# Altium project PROC154E3_SCH.PrjPcb (part 39 of 60)

## Sheet 44. SGMII EXPANSION HDR.SchDoc: ENET EXPANSION CONNECTOR
size 513 x 386 mm; Project: PROC154E2(001)_SK_AM69; Issue: 1.0; RevCode: E3; Page Create Date: March  8, 1995; Variant Name: Core Design; Schematic Page Number: 44; Page Number: 44; Page Size: C; Comment: MISTRAL_TITLEBLK_CSIZE_1; Page Count: 62; Schematic Page Count: 62; Name: PROC154E2 001 SK AM69; DsnPath: C:\Users\danie\Downloads\sprr466c\PROC154E3_RP\PROC154E3_SCH.DSN; SchematicName: SCHEMATIC1; PageName: 44. SGMII EXPANSION HDR; PageSize: C; TopSchematic: True
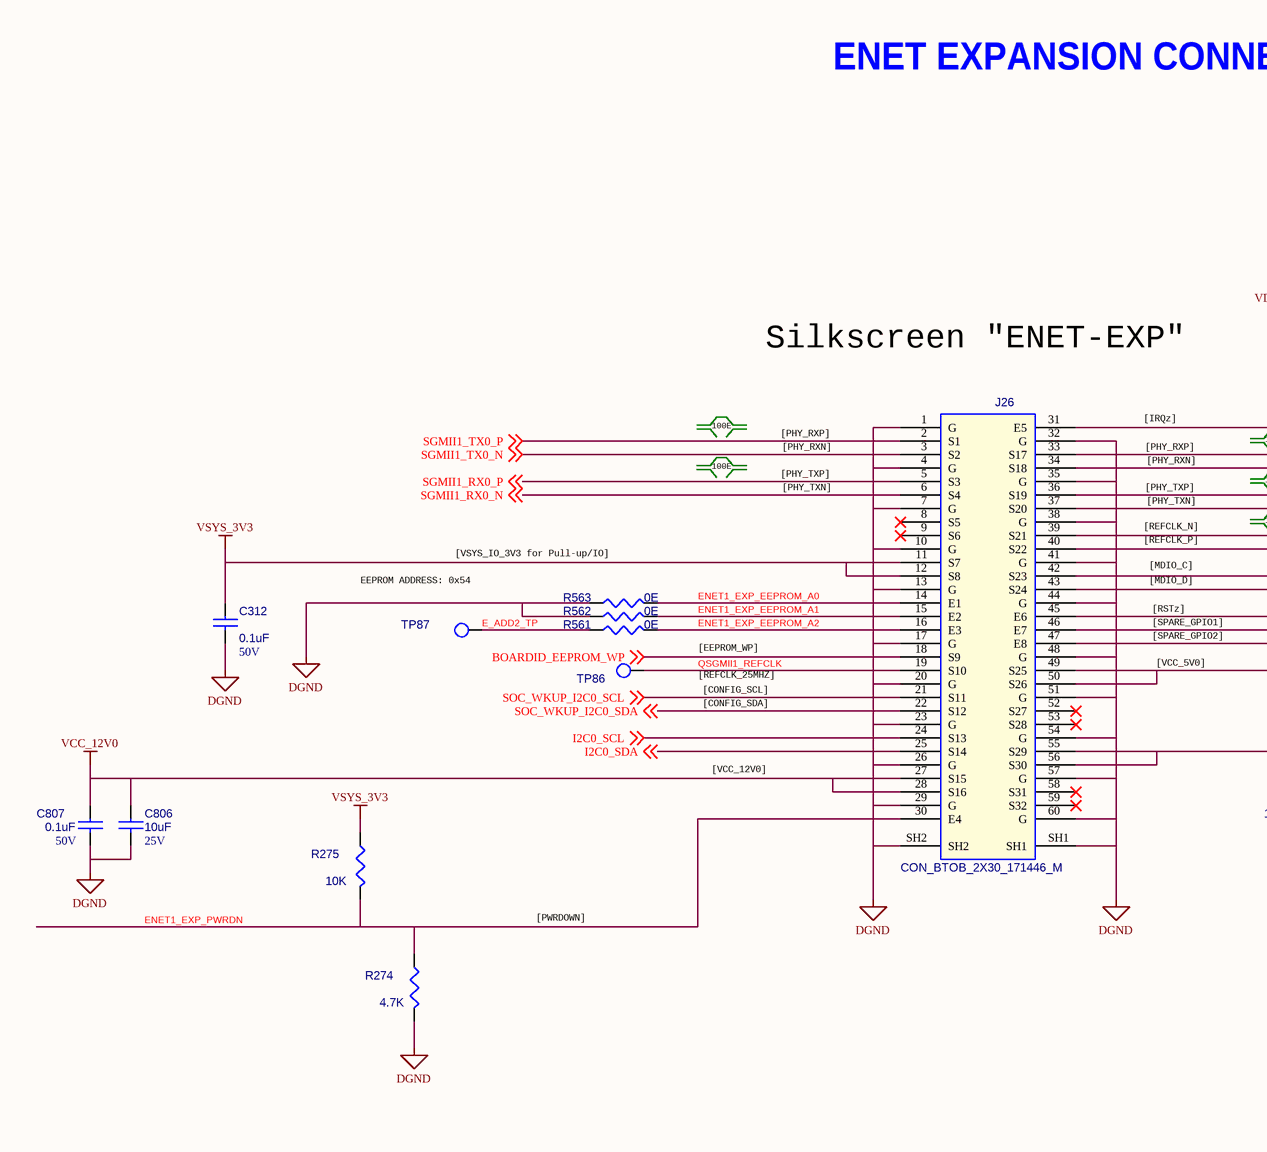
[diagram p72: 44. SGMII EXPANSION HDR.SchDoc, left]
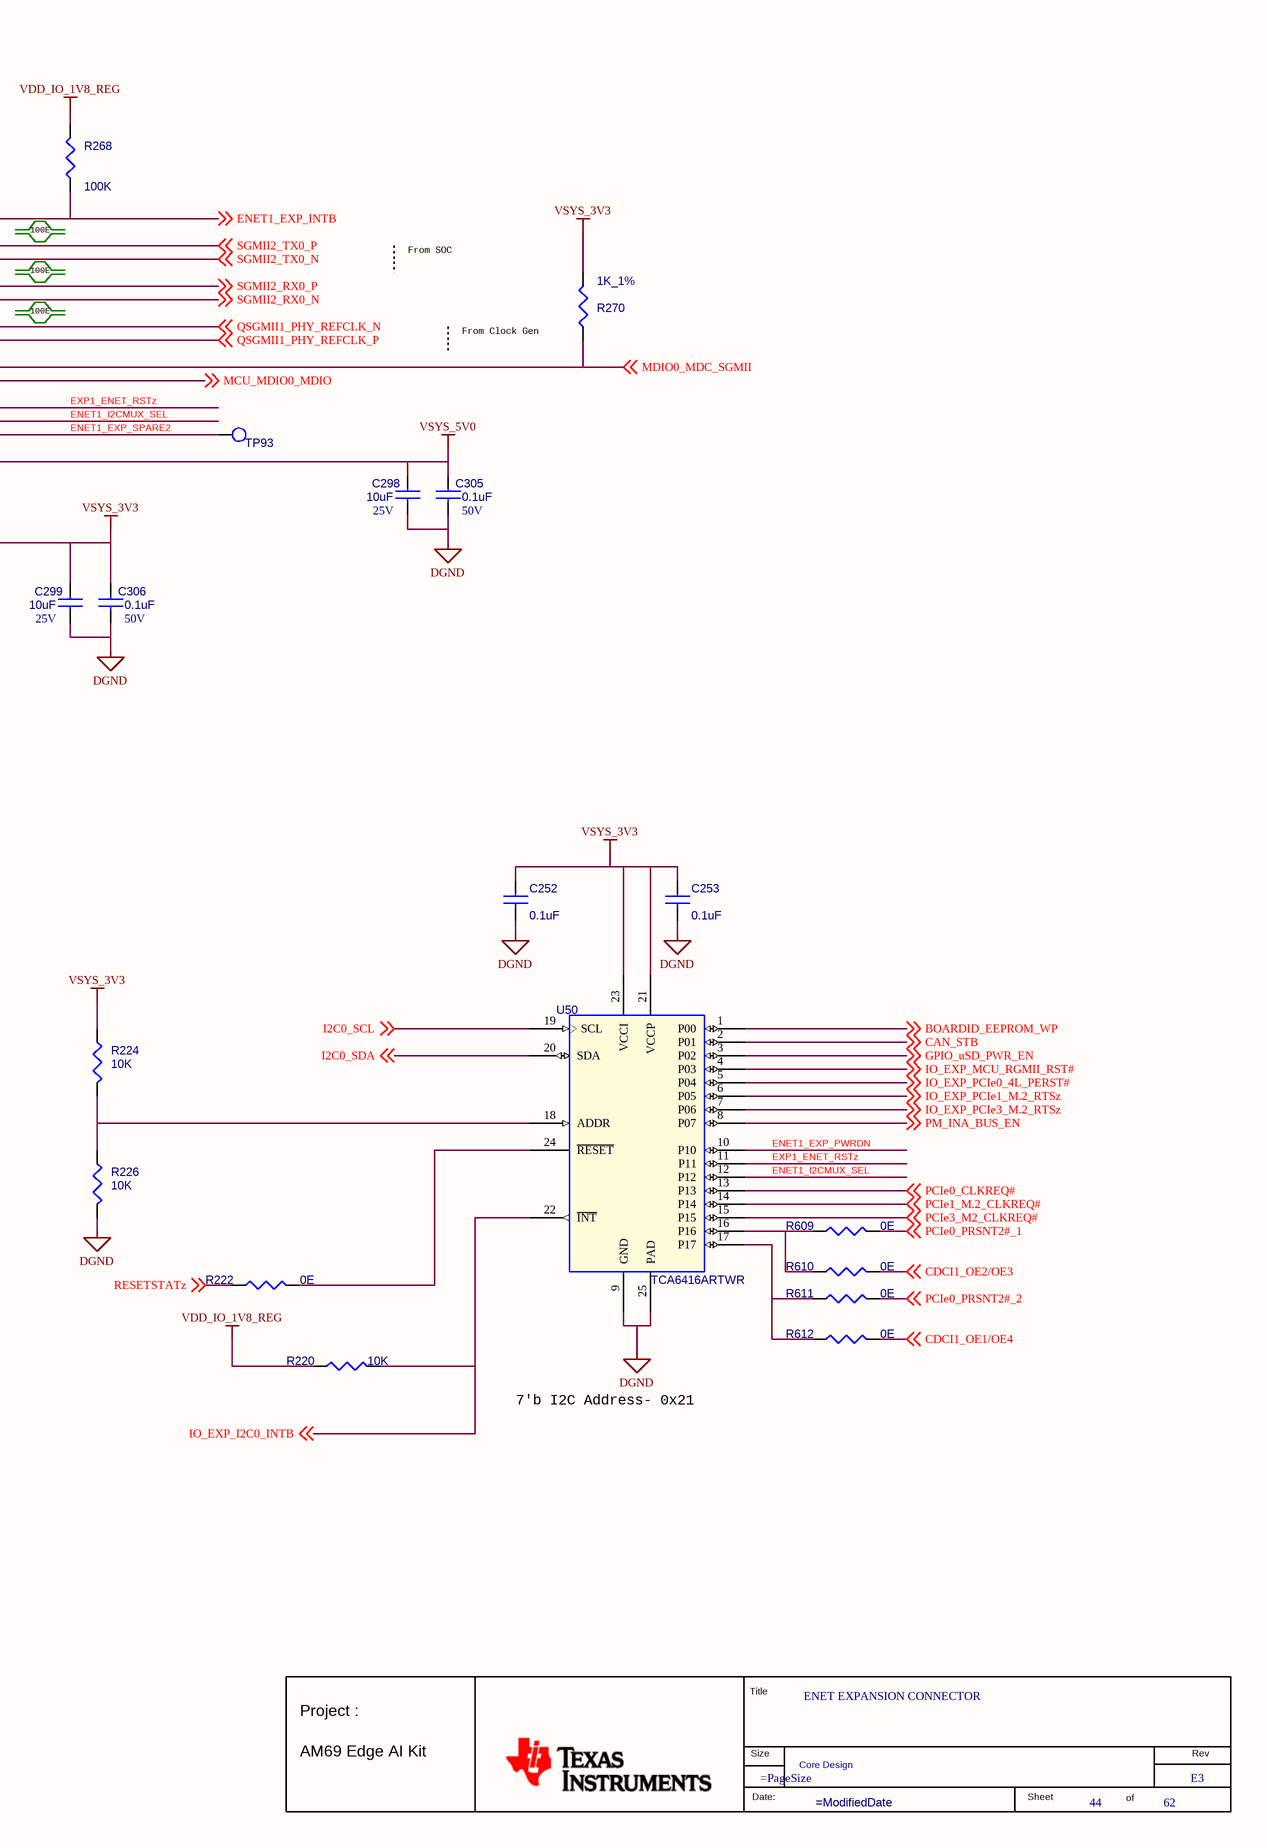
[diagram p73: 44. SGMII EXPANSION HDR.SchDoc, right]

### Parts
(Parts that share a designator on the sheet are numbered #1, #2 ... from top to bottom, then left to right.)
*#44  RevCode: E3  Title: ENET EXPANSION CONNECTOR  Page Number: 44  Page Count: 62  Variant Name: Core Design  (hidden comment: MISTRAL_TITLEBLK_CSIZE_1)  (graphical)
C252  0.1uF  [CAP0201_0-5]
C253  0.1uF  [CAP0201_0-5]
C298  10uF  Voltage: 25V  [CAP0603_1-25]
C299  10uF  Voltage: 25V  [CAP0603_1-25]
C305  0.1uF  Voltage: 50V  [CAP0402_0-75]
C306  0.1uF  Voltage: 50V  [CAP0402_0-75]
C312  0.1uF  Voltage: 50V  [CAP0402_0-75]
C806  10uF  Voltage: 25V  [CAP0603_1-25]
C807  0.1uF  Voltage: 50V  [CAP0402_0-75]
J26  CON_BTOB_2X30_171446_M  [CON_BTOB2X30_171446-09_P_S_S_3-5]
R220  10K  [RES0201_0-5]
R222  0E  [RES0201_0-5]
R224  10K  [RES0201_0-5]
R226  10K  [RES0201_0-5]
R268  100K  [RES0402_0-5]
R270  1K_1%  [RES0402_0-5]
R274  4.7K  [RES0402_0-5]
R275  10K  [RES0402_0-5]
R561  0E  [RES0402_0-5]
R562  0E  [RES0402_0-5]
R563  0E  [RES0402_0-5]
R609  0E  [RES0201_0-5]
R610  0E  [RES0201_0-5]
R611  0E  [RES0201_0-5]
R612  0E  [RES0201_0-5]
TP86  TP40_SMD  [TP40_SMD]  (value not drawn)
TP87  TP40_SMD  [TP40_SMD]  (value not drawn)
TP93  TP40_SMD  [TP40_SMD]  (value not drawn)
U50  TCA6416ARTWR  [WQFN24_19-68_160X160]

### Nets
DGND: C252.2 C253.2 C298.2 C299.2 C305.2 C306.2 C312.2 C806.2 C807.2 J26.1(G) J26.4(G) J26.7(G) J26.10(G) J26.13(G) J26.17(G) J26.20(G) J26.23(G) J26.26(G) J26.29(G) J26.32(G) J26.35(G) J26.38(G) J26.41(G) J26.44(G) J26.48(G) J26.51(G) J26.54(G) J26.57(G) J26.60(G) J26.SH1 J26.SH2 R226.1 R274.2 R562.1 R563.1 U50.9(GND) U50.25(PAD)  [project net VDD_CPU_HCPS_GOSNS]
VCC_12V0: C806.1 C807.1 J26.27(S15) J26.28(S16)
VDD_IO_1V8_REG: R220.2 R268.2
VSYS_3V3: C252.1 C253.1 C299.1 C306.1 C312.1 J26.11(S7) J26.12(S8) J26.55(S29) J26.56(S30) R224.2 R270.1 R275.1 U50.21(VCCP) U50.23(VCCI)  [project net V_3V3]
VSYS_5V0: C298.1 C305.1 J26.49(S25) J26.50(S26)
BOARDID_EEPROM_WP: J26.18(S9) U50.1(P00) ; off-sheet BOARDID_EEPROM_WP
CAN_STB: U50.2(P01) ; off-sheet CAN_STB
CDCI1_OE1/OE4: R612.2 ; off-sheet CDCI1_OE1/OE4  [project net CDCI1_OE4]
CDCI1_OE2/OE3: R610.2 ; off-sheet CDCI1_OE2/OE3  [project net CDCI1_OE2]
E_ADD2_TP: R561.1 TP87.1(TP)
ENET1_EXP_EEPROM_A0: J26.14(E1) R563.2
ENET1_EXP_EEPROM_A1: J26.15(E2) R562.2
ENET1_EXP_EEPROM_A2: J26.16(E3) R561.2
ENET1_EXP_INTB: J26.31(E5) R268.1 ; off-sheet ENET1_EXP_INTB
ENET1_EXP_PWRDN: J26.30(E4) R274.1 R275.2 U50.10(P10)
ENET1_EXP_SPARE2: J26.47(E8) TP93.1(TP)
ENET1_I2CMUX_SEL: J26.46(E7) U50.12(P12)
EXP1_ENET_RSTz: J26.45(E6) U50.11(P11)
GPIO_uSD_PWR_EN: U50.3(P02) ; off-sheet GPIO_uSD_PWR_EN
I2C0_SCL: J26.24(S13) U50.19(SCL) ; off-sheet I2C0_SCL
I2C0_SDA: J26.25(S14) U50.20(SDA) ; off-sheet I2C0_SDA
IO_EXP_I2C0_INTB: R220.1 U50.22(~{INT}) ; off-sheet IO_EXP_I2C0_INTB
IO_EXP_MCU_RGMII_RST#: U50.4(P03) ; off-sheet IO_EXP_MCU_RGMII_RST#
IO_EXP_PCIe0_4L_PERST#: U50.5(P04) ; off-sheet IO_EXP_PCIe0_4L_PERST#
IO_EXP_PCIe1_M.2_RTSz: U50.6(P05) ; off-sheet IO_EXP_PCIe1_M.2_RTSz
IO_EXP_PCIe3_M.2_RTSz: U50.7(P06) ; off-sheet IO_EXP_PCIe3_M.2_RTSz
MCU_MDIO0_MDIO: J26.43(S24) ; off-sheet MCU_MDIO0_MDIO
MDIO0_MDC_SGMII: J26.42(S23) R270.2 ; off-sheet MDIO0_MDC_SGMII
PCIe0_CLKREQ#: U50.13(P13) ; off-sheet PCIe0_CLKREQ#
PCIE0_PRSNT2#_1: R609.2 ; off-sheet PCIe0_PRSNT2#_1
PCIe0_PRSNT2#_2: R611.2 ; off-sheet PCIe0_PRSNT2#_2
PCIe1_M.2_CLKREQ#: U50.14(P14) ; off-sheet PCIe1_M.2_CLKREQ#
PCIe3_M2_CLKREQ#: U50.15(P15) ; off-sheet PCIe3_M2_CLKREQ#  [project net PCIe3_M.2_CLKREQ#]
PM_INA_BUS_EN: U50.8(P07) ; off-sheet PM_INA_BUS_EN
QSGMII1_PHY_REFCLK_N: J26.39(S21) ; off-sheet QSGMII1_PHY_REFCLK_N
QSGMII1_PHY_REFCLK_P: J26.40(S22) ; off-sheet QSGMII1_PHY_REFCLK_P
QSGMII1_REFCLK: J26.19(S10) TP86.1(TP)
RESETSTATZ: R222.1 ; off-sheet RESETSTATz
SGMII1_RX0_N: J26.6(S4) ; off-sheet SGMII1_RX0_N
SGMII1_RX0_P: J26.5(S3) ; off-sheet SGMII1_RX0_P
SGMII1_TX0_N: J26.3(S2) ; off-sheet SGMII1_TX0_N
SGMII1_TX0_P: J26.2(S1) ; off-sheet SGMII1_TX0_P
SGMII2_RX0_N: J26.37(S20) ; off-sheet SGMII2_RX0_N
SGMII2_RX0_P: J26.36(S19) ; off-sheet SGMII2_RX0_P
SGMII2_TX0_N: J26.34(S18) ; off-sheet SGMII2_TX0_N
SGMII2_TX0_P: J26.33(S17) ; off-sheet SGMII2_TX0_P
SOC_WKUP_I2C0_SCL: J26.21(S11) ; off-sheet SOC_WKUP_I2C0_SCL
SOC_WKUP_I2C0_SDA: J26.22(S12) ; off-sheet SOC_WKUP_I2C0_SDA
NetR222_2: R222.2 U50.24(~{RESET})
NetR224_1: R224.1 R226.2 U50.18(ADDR)
NetR609_1: R609.1 R610.1 U50.16(P16)
NetR611_1: R611.1 R612.1 U50.17(P17)

Not connected (* = marked no-connect by the designer): J26 8(S5)* 9(S6)* 52(S27)* 53(S28)* 58(S31)* 59(S32)*

### Notes on the sheet
- ENET EXPANSION CONNECTOR
- Silkscreen "ENET-EXP"
- 100E
- [PHY_RXP]
- [IRQz]
- (near R268) 100E
- [PHY_TXP]
- [PHY_TXN]
- [PHY_RXN]
- From SOC
- [VSYS_IO_3V3 for Pull-up/IO]
- [REFCLK_N]
- [REFCLK_P]
- [MDIO_C]
- (near R270) From Clock Gen
- (near TP87) EEPROM ADDRESS: 0x54
- [MDIO_D]
- [RSTz]
- [SPARE_GPIO2]
- [SPARE_GPIO1]
- [EEPROM_WP]
- [REFCLK_25MHZ]
- [CONFIG_SDA]
- [CONFIG_SCL]
- [VCC_5V0]
- [VCC_12V0]
- [PWRDOWN]
- 7'b I2C Address- 0x21
- (in symbol MISTRAL_TITLEBLK_CSIZE_1) Title; Project :; Size; Rev; AM69 Edge AI Kit; Date:; Sheet; of

### Library data of the parts
*#44 = MISTRAL_TITLEBLK_CSIZE_1: Issue: 1.0; Project: PROC154E2(001)_SK_AM69; Name: PROC154E2 001 SK AM69; Page Create Date: March  8, 1995; Page Size: =PageSize; Page Modify Date: =ModifiedDate; Schematic Page Count: 62; Schematic Page Number: 44
C252 = CAP_Dup1: CAP CERAMIC 0.1uF 16V 10% X7S AUTO 0201; Part Reference: C252; Part_type: CAPACITORS\CERAMIC; Mfr_part_number: GRT033C71C104KE01D; Mfr_name: MURATA; Mistral Part No: 120021030007-R; Custom_Duty: 15%; Customs_HS_Code: 85322990; Wattage: NA; Project: J7ES_SK_BRD; Value: 0.1uF; PCB Footprint: CAP0201_0-5; MECHANICAL 3D STEP FILE: CAP0201_0-5; Chkd/date: MANIRAJA/110321; Crtd /date: ALVY/110321; Datasheet: Y:\MIS_DATABASE\DATASHEETS\CAPACITORS\GRT033C71C104KE01.PDF; Temperature: -55°C+125°C; Weight: 330mg; Height: 0.33MM; Distributor_part_number: 490-GRT033C71C104KE01DTR-ND; Distributor_name: DIGIKEY; Package: 0201; Voltage: 16V; Tolerance: 10%
C253 = CAP_Dup1: CAP CERAMIC 0.1uF 16V 10% X7S AUTO 0201; Part Reference: C253; Part_type: CAPACITORS\CERAMIC; Mfr_part_number: GRT033C71C104KE01D; Mfr_name: MURATA; Mistral Part No: 120021030007-R; Custom_Duty: 15%; Customs_HS_Code: 85322990; Wattage: NA; Project: J7ES_SK_BRD; Value: 0.1uF; PCB Footprint: CAP0201_0-5; MECHANICAL 3D STEP FILE: CAP0201_0-5; Chkd/date: MANIRAJA/110321; Crtd /date: ALVY/110321; Datasheet: Y:\MIS_DATABASE\DATASHEETS\CAPACITORS\GRT033C71C104KE01.PDF; Temperature: -55°C+125°C; Weight: 330mg; Height: 0.33MM; Distributor_part_number: 490-GRT033C71C104KE01DTR-ND; Distributor_name: DIGIKEY; Package: 0201; Voltage: 16V; Tolerance: 10%
C298 = CAP_Dup1: CAP CERAMIC 10uF 25V 20% X5R 0603; Part Reference: C298; Mistral Part No: 120018070001-R; Mfr_name: MURATA; Mfr_part_number: ZRB18AR61E106ME01L; Part_type: CAPACITORS\CERAMIC; Direct Alternate_mfr_name: TDK; Direct Alternate_mfr_part_number: C1608X5R1E106M080AC; Automotive Alternate_mfr_part_number: GRT188R61E106ME13D; Project: CABS_VME_DIO; Wattage: NA; Customs_HS_Code: 85322990; Custom_Duty: 15%; Value: 10uF; PCB Footprint: CAP0603_1-25; Library Ref: CAP; Tolerance: 20%; Package: 0603; Distributor_name: DIGIKEY; Distributor_part_number: 490-10991-1-ND; Height: 1.20MM; Weight: 2mg; Temperature: -55°C+85°C; Datasheet: Y:\MIS_DATABASE\DATASHEETS\CAPACITORS\ZRB18AR61E106ME01L.PDF; Crtd /date: MANIRAJA/040718; Chkd/date: MANIRAJA/040718; MECHANICAL 3D STEP FILE: CAP0603_1-25; Footprint Ref: CAP0603_1-25; Library Path: Y:\MIS_DATABASE\Library\ALTIUM_TOOL\SCHEMATICS_PARTS\MS_DISCRETE_Library.schlib; Footprint Path: Y:\MIS_DATABASE\Library\ALTIUM_TOOL\PCB_FOOTPRINTS\Altium_Footprint_Lib.PcbLib; Automotive Alternate_mfr_name: MURATA; Manufacturer: MURATA
C299 = CAP_Dup1: CAP CERAMIC 10uF 25V 20% X5R 0603; Part Reference: C299; Part_type: CAPACITORS\CERAMIC; Mfr_part_number: ZRB18AR61E106ME01L; Mfr_name: MURATA; Mistral Part No: 120018070001-R; Direct Alternate_mfr_name: TDK; Direct Alternate_mfr_part_number: C1608X5R1E106M080AC; Automotive Alternate_mfr_part_number: GRT188R61E106ME13D; Custom_Duty: 15%; Customs_HS_Code: 85322990; Wattage: NA; Project: CABS_VME_DIO; Value: 10uF; PCB Footprint: CAP0603_1-25; MECHANICAL 3D STEP FILE: CAP0603_1-25; Chkd/date: MANIRAJA/040718; Crtd /date: MANIRAJA/040718; Datasheet: Y:\MIS_DATABASE\DATASHEETS\CAPACITORS\ZRB18AR61E106ME01L.PDF; Temperature: -55°C+85°C; Weight: 2mg; Height: 1.20MM; Distributor_part_number: 490-10991-1-ND; Distributor_name: DIGIKEY; Package: 0603; Tolerance: 20%; Library Ref: CAP; Footprint Ref: CAP0603_1-25; Library Path: Y:\MIS_DATABASE\Library\ALTIUM_TOOL\SCHEMATICS_PARTS\MS_DISCRETE_Library.schlib; Footprint Path: Y:\MIS_DATABASE\Library\ALTIUM_TOOL\PCB_FOOTPRINTS\Altium_Footprint_Lib.PcbLib; Automotive Alternate_mfr_name: MURATA; Manufacturer: MURATA
C305 = CAP_Dup1: CAP CERAMIC 0.1uF 50V 10% X7R 0402; Part Reference: C305; Manufacturer: MURATA; Automotive Alternate_mfr_part_number: CGA2B3X7R1H104K050BB; Automotive Alternate_mfr_name: TDK; Direct Alternate_mfr_part_number: C1005X7R1H104K050BE; Mistral Part No: 120011100014-R; Mfr_part_number: GRM155R71H104KE14D; Part_type: CAPACITORS\CERAMIC; Project: J7_CP; Wattage: NA; Customs_HS_Code: 85322990; Custom_Duty: 15%; Value: 0.1uF; PCB Footprint: CAP0402_0-75; Direct Alternate_mfr_name: TDK; Footprint Ref: CAP0402_0-75; Mfr_name: MURATA; Tolerance: 10%; Package: 0402; Distributor_name: DIGIKEY; Distributor_part_number: 490-10700-1-ND; Library Ref: CAP; Height: 0.55MM; Temperature: -55°C+125°C; Datasheet: Y:\MIS_DATABASE\DATASHEETS\CAPACITORS\GRM155R71H104KE14.PDF; Crtd /date: ALVY/211020; Chkd/date: MANIRAJA/261020; Library Path: Y:\MIS_DATABASE\Library\ALTIUM_TOOL\SCHEMATICS_PARTS\MS_DISCRETE_Library.schlib; Footprint Path: Y:\MIS_DATABASE\Library\ALTIUM_TOOL\PCB_FOOTPRINTS\Altium_Footprint_Lib.PcbLib; Weight: 3.1mg; MECHANICAL 3D STEP FILE: CAP0402_0-75
C306 = CAP_Dup1: CAP CERAMIC 0.1uF 50V 10% X7R 0402; Part Reference: C306; Mistral Part No: 120011100014-R; Mfr_name: MURATA; Mfr_part_number: GRM155R71H104KE14D; Part_type: CAPACITORS\CERAMIC; Direct Alternate_mfr_name: TDK; Direct Alternate_mfr_part_number: C1005X7R1H104K050BE; Automotive Alternate_mfr_part_number: CGA2B3X7R1H104K050BB; Project: J7_CP; Wattage: NA; Customs_HS_Code: 85322990; Custom_Duty: 15%; Value: 0.1uF; PCB Footprint: CAP0402_0-75; Footprint Ref: CAP0402_0-75; Tolerance: 10%; Package: 0402; Distributor_name: DIGIKEY; Distributor_part_number: 490-10700-1-ND; Library Ref: CAP; Height: 0.55MM; Temperature: -55°C+125°C; Datasheet: Y:\MIS_DATABASE\DATASHEETS\CAPACITORS\GRM155R71H104KE14.PDF; Crtd /date: ALVY/211020; Chkd/date: MANIRAJA/261020; Library Path: Y:\MIS_DATABASE\Library\ALTIUM_TOOL\SCHEMATICS_PARTS\MS_DISCRETE_Library.schlib; Footprint Path: Y:\MIS_DATABASE\Library\ALTIUM_TOOL\PCB_FOOTPRINTS\Altium_Footprint_Lib.PcbLib; Weight: 3.1mg; MECHANICAL 3D STEP FILE: CAP0402_0-75; Automotive Alternate_mfr_name: TDK; Manufacturer: MURATA
C312 = CAP_Dup1: CAP CERAMIC 0.1uF 50V 10% X7R 0402; Part Reference: C312; Part_type: CAPACITORS\CERAMIC; Mfr_part_number: GRM155R71H104KE14D; Mfr_name: MURATA; Mistral Part No: 120011100014-R; Direct Alternate_mfr_name: TDK; Direct Alternate_mfr_part_number: C1005X7R1H104K050BE; Automotive Alternate_mfr_part_number: CGA2B3X7R1H104K050BB; Custom_Duty: 15%; Customs_HS_Code: 85322990; Wattage: NA; Project: J7_CP; Value: 0.1uF; PCB Footprint: CAP0402_0-75; MECHANICAL 3D STEP FILE: CAP0402_0-75; Weight: 3.1mg; Footprint Path: Y:\MIS_DATABASE\Library\ALTIUM_TOOL\PCB_FOOTPRINTS\Altium_Footprint_Lib.PcbLib; Library Path: Y:\MIS_DATABASE\Library\ALTIUM_TOOL\SCHEMATICS_PARTS\MS_DISCRETE_Library.schlib; Chkd/date: MANIRAJA/261020; Crtd /date: ALVY/211020; Datasheet: Y:\MIS_DATABASE\DATASHEETS\CAPACITORS\GRM155R71H104KE14.PDF; Temperature: -55°C+125°C; Height: 0.55MM; Library Ref: CAP; Distributor_part_number: 490-10700-1-ND; Distributor_name: DIGIKEY; Package: 0402; Tolerance: 10%; Footprint Ref: CAP0402_0-75; Automotive Alternate_mfr_name: TDK; Manufacturer: MURATA
C806 = CAP_Dup1: CAP CERAMIC 10uF 25V 20% X5R 0603; Part Reference: C806; Manufacturer: MURATA; Automotive Alternate_mfr_part_number: GRT188R61E106ME13D; Direct Alternate_mfr_part_number: C1608X5R1E106M080AC; Direct Alternate_mfr_name: TDK; Part_type: CAPACITORS\CERAMIC; Mfr_part_number: ZRB18AR61E106ME01L; Mistral Part No: 120018070001-R; Custom_Duty: 15%; Customs_HS_Code: 85322990; Wattage: NA; Project: CABS_VME_DIO; Value: 10uF; PCB Footprint: CAP0603_1-25; Automotive Alternate_mfr_name: MURATA; Footprint Path: Y:\MIS_DATABASE\Library\ALTIUM_TOOL\PCB_FOOTPRINTS\Altium_Footprint_Lib.PcbLib; Library Path: Y:\MIS_DATABASE\Library\ALTIUM_TOOL\SCHEMATICS_PARTS\MS_DISCRETE_Library.schlib; Footprint Ref: CAP0603_1-25; MECHANICAL 3D STEP FILE: CAP0603_1-25; Chkd/date: MANIRAJA/040718; Crtd /date: MANIRAJA/040718; Datasheet: Y:\MIS_DATABASE\DATASHEETS\CAPACITORS\ZRB18AR61E106ME01L.PDF; Temperature: -55°C+85°C; Weight: 2mg; Height: 1.20MM; Distributor_part_number: 490-10991-1-ND; Distributor_name: DIGIKEY; Package: 0603; Tolerance: 20%; Mfr_name: MURATA; Library Ref: CAP
C807 = CAP_Dup1: CAP CERAMIC 0.1uF 50V 10% X7R 0402; Part Reference: C807; Mistral Part No: 120011100014-R; Mfr_name: MURATA; Mfr_part_number: GRM155R71H104KE14D; Part_type: CAPACITORS\CERAMIC; Direct Alternate_mfr_name: TDK; Direct Alternate_mfr_part_number: C1005X7R1H104K050BE; Automotive Alternate_mfr_part_number: CGA2B3X7R1H104K050BB; Project: J7_CP; Wattage: NA; Customs_HS_Code: 85322990; Custom_Duty: 15%; Value: 0.1uF; PCB Footprint: CAP0402_0-75; Footprint Ref: CAP0402_0-75; Tolerance: 10%; Package: 0402; Distributor_name: DIGIKEY; Distributor_part_number: 490-10700-1-ND; Library Ref: CAP; Height: 0.55MM; Temperature: -55°C+125°C; Datasheet: Y:\MIS_DATABASE\DATASHEETS\CAPACITORS\GRM155R71H104KE14.PDF; Crtd /date: ALVY/211020; Chkd/date: MANIRAJA/261020; Library Path: Y:\MIS_DATABASE\Library\ALTIUM_TOOL\SCHEMATICS_PARTS\MS_DISCRETE_Library.schlib; Footprint Path: Y:\MIS_DATABASE\Library\ALTIUM_TOOL\PCB_FOOTPRINTS\Altium_Footprint_Lib.PcbLib; Weight: 3.1mg; MECHANICAL 3D STEP FILE: CAP0402_0-75; Automotive Alternate_mfr_name: TDK; Manufacturer: MURATA
J26 = CON_BTOB_30X2_171446: CON BTOB 2X30 0.80MM PITCH MALE ST SMD; Part Reference: J26; Mistral Part No: 150018090011-R; Mfr_name: MOLEX; Mfr_part_number: 171446-1109; Part_type: CONNECTOR\BTOB; Project: TI_J7ES_EVM_CP; Tolerance: NA; Customs_HS_Code: 85369090; Custom_Duty: 24%; Value: CON_BTOB_2X30_171446_M; PCB Footprint: CON_BTOB2X30_171446-09_P_S_S_3-5; Footprint Ref: CON_BTOB2X30_171446-09_P_S_S_3-5; Voltage: NA; Wattage: NA; Package: SMD; Distributor_name: MOUSER; Distributor_part_number: 538-171446-1109; Library Ref: CON_BTOB_30X2_171446; Height: 3.50MM; Weight: 314mg; Temperature: -40°C+105°C; Datasheet: Y:\MIS_DATABASE\DATASHEETS\CONNECTORS\171446-SER.PDF; Crtd /date: ALVY/060918; Chkd/date: MANIRAJA/060918; MECHANICAL 3D STEP FILE: CON_BTOB2X30_171446-09_P_S_S_3-5; Library Path: Y:\MIS_DATABASE\Library\ALTIUM_TOOL\SCHEMATICS_PARTS\MS_CONNECTOR_Library.schlib; Footprint Path: Y:\MIS_DATABASE\Library\ALTIUM_TOOL\PCB_FOOTPRINTS\Altium_Footprint_Lib.PcbLib; Manufacturer: MOLEX
R220 = RESISTOR_Dup2: RES 10K 1/20W 5% 0201; Part Reference: R220; Mistral Part No: 110010070051-R; Mfr_name: YAGEO AMERICA; Mfr_part_number: RC0201JR-0710KL; Part_type: RESISTORS\FIXED; Project: GOLDEN-I LITE; Voltage: NA; Customs_HS_Code: 85332119; Custom_Duty: 15%; Value: 10K; PCB Footprint: RES0201_0-5; Footprint Path: Y:\MIS_DATABASE\Library\ALTIUM_TOOL\PCB_FOOTPRINTS\Altium_Footprint_Lib.PcbLib; Library Path: Y:\MIS_DATABASE\Library\ALTIUM_TOOL\SCHEMATICS_PARTS\MS_DISCRETE_Library.schlib; Footprint Ref: RES0201_0-5; Library Ref: RESISTOR; Tolerance: 5%; Wattage: 1/20W; Package: 0201; Distributor_name: DIGIKEY; Distributor_part_number: 311-10KNCT-ND; Height: 0.26MM; Weight: 0.17mg; Temperature: -55°C+125°C; Datasheet: Y:\MIS_DATABASE\DATASHEETS\RESISTORS\RCXXXXL-SER_MAR18.PDF; Crtd /date: MANIRAJA/050517; Chkd/date: MANIRAJA/050517; MECHANICAL 3D STEP FILE: RES0201_0-5
R222 = RESISTOR_Dup2: RES 0E 1/20W JUMPER 0201; Part Reference: R222; Mistral Part No: 110009030078-R; Mfr_name: PANASONIC-ECG; Mfr_part_number: ERJ-1GN0R00C; Part_type: RESISTORS\FIXED; Project: SRMS-SAR_BRD; Tolerance: NA; Customs_HS_Code: 85332119; Custom_Duty: 15%; Value: 0E; PCB Footprint: RES0201_0-5; Footprint Ref: RES0201_0-5; Voltage: NA; Wattage: 1/20W; Package: 0201; Distributor_name: DIGIKEY; Distributor_part_number: P15979CT-ND; Library Ref: RESISTOR; Height: 0.26MM; Weight: 0.15mg; Temperature: -55°C+125°C; Datasheet: Y:\MIS_DATABASE\DATASHEETS\RESISTORS\PAN-ERJSER_NOV17.PDF; Crtd /date: ALVY/290421; Chkd/date: MANIRAJA/290421; MECHANICAL 3D STEP FILE: RES0201_0-5; Library Path: Y:\MIS_DATABASE\Library\ALTIUM_TOOL\SCHEMATICS_PARTS\MS_DISCRETE_Library.schlib; Footprint Path: Y:\MIS_DATABASE\Library\ALTIUM_TOOL\PCB_FOOTPRINTS\Altium_Footprint_Lib.PcbLib
R224 = RESISTOR_Dup2: RES 10K 1/20W 5% 0201; Part Reference: R224; Part_type: RESISTORS\FIXED; Mfr_part_number: RC0201JR-0710KL; Mfr_name: YAGEO AMERICA; Mistral Part No: 110010070051-R; Custom_Duty: 15%; Customs_HS_Code: 85332119; Voltage: NA; Project: GOLDEN-I LITE; Value: 10K; PCB Footprint: RES0201_0-5; MECHANICAL 3D STEP FILE: RES0201_0-5; Chkd/date: MANIRAJA/050517; Crtd /date: MANIRAJA/050517; Datasheet: Y:\MIS_DATABASE\DATASHEETS\RESISTORS\RCXXXXL-SER_MAR18.PDF; Temperature: -55°C+125°C; Weight: 0.17mg; Height: 0.26MM; Distributor_part_number: 311-10KNCT-ND; Distributor_name: DIGIKEY; Package: 0201; Wattage: 1/20W; Tolerance: 5%; Library Ref: RESISTOR; Footprint Ref: RES0201_0-5; Library Path: Y:\MIS_DATABASE\Library\ALTIUM_TOOL\SCHEMATICS_PARTS\MS_DISCRETE_Library.schlib; Footprint Path: Y:\MIS_DATABASE\Library\ALTIUM_TOOL\PCB_FOOTPRINTS\Altium_Footprint_Lib.PcbLib
R226 = RESISTOR_Dup2: RES 10K 1/20W 5% 0201; Part Reference: R226; Part_type: RESISTORS\FIXED; Mfr_part_number: RC0201JR-0710KL; Mfr_name: YAGEO AMERICA; Mistral Part No: 110010070051-R; Custom_Duty: 15%; Customs_HS_Code: 85332119; Voltage: NA; Project: GOLDEN-I LITE; Value: 10K; PCB Footprint: RES0201_0-5; MECHANICAL 3D STEP FILE: RES0201_0-5; Chkd/date: MANIRAJA/050517; Crtd /date: MANIRAJA/050517; Datasheet: Y:\MIS_DATABASE\DATASHEETS\RESISTORS\RCXXXXL-SER_MAR18.PDF; Temperature: -55°C+125°C; Weight: 0.17mg; Height: 0.26MM; Distributor_part_number: 311-10KNCT-ND; Distributor_name: DIGIKEY; Package: 0201; Wattage: 1/20W; Tolerance: 5%; Library Ref: RESISTOR; Footprint Ref: RES0201_0-5; Library Path: Y:\MIS_DATABASE\Library\ALTIUM_TOOL\SCHEMATICS_PARTS\MS_DISCRETE_Library.schlib; Footprint Path: Y:\MIS_DATABASE\Library\ALTIUM_TOOL\PCB_FOOTPRINTS\Altium_Footprint_Lib.PcbLib
R268 = RESISTOR_Dup2: RES 100K 1/10W 5% 0402; Part Reference: R268; Manufacturer: PANASONIC-ECG; Part_type: RESISTORS\FIXED; Mfr_part_number: ERJ-2GEJ104X; Mistral Part No: 110009030177-R; Custom_Duty: 15%; Customs_HS_Code: 85332119; Voltage: NA; Project: RED EYE; Value: 100K; Library Ref: RESISTOR; Chkd/date: VASANTHA/291216; Crtd /date: GEETHA/190406; Datasheet: Y:\MIS_DATABASE\DATASHEETS\RESISTORS\PAN-ERJSER_NOV17.PDF; Temperature: -55°C+155°C; Weight: 0.8mg; Height: 0.40MM; Distributor_part_number: P100KJCT-ND; Distributor_name: DIGIKEY; Package: 0402; Wattage: 1/10W; Tolerance: 5%; Mfr_name: PANASONIC-ECG; Footprint Ref: RES0402_0-5; MECHANICAL 3D STEP FILE: RES0402_0-5; Library Path: Y:\MIS_DATABASE\Library\ALTIUM_TOOL\SCHEMATICS_PARTS\MS_DISCRETE_Library.schlib; Footprint Path: Y:\MIS_DATABASE\Library\ALTIUM_TOOL\PCB_FOOTPRINTS\Altium_Footprint_Lib.PcbLib; PCB Footprint: RES0402_0-5
R270 = RESISTOR_Dup1: RES 1K 1/10W 1% 0402; Part Reference: R270; Part_type: RESISTORS\FIXED; Mfr_part_number: ERJ-2RKF1001X; Mfr_name: PANASONIC-ECG; Mistral Part No: 110009030411-R; Custom_Duty: 15%; Customs_HS_Code: 85332119; Voltage: NA; Project: VOCERA; Value: 1K_1%; PCB Footprint: RES0402_0-5; Footprint Path: Y:\MIS_DATABASE\Library\ALTIUM_TOOL\PCB_FOOTPRINTS\Altium_Footprint_Lib.PcbLib; Library Path: Y:\MIS_DATABASE\Library\ALTIUM_TOOL\SCHEMATICS_PARTS\MS_DISCRETE_Library.schlib; MECHANICAL 3D STEP FILE: RES0402_0-5; Footprint Ref: RES0402_0-5; Chkd/date: VASANTHA/281216; Crtd /date: MAZHAR/150506; Datasheet: Y:\MIS_DATABASE\DATASHEETS\RESISTORS\PAN-ERJSER_NOV17.PDF; Temperature: -55°C+155°C; Weight: 0.8mg; Height: 0.40MM; Distributor_part_number: P1.00KLCT-ND; Distributor_name: DIGIKEY; Package: 0402; Wattage: 1/10W; Tolerance: 1%; Library Ref: RESISTOR; Manufacturer: PANASONIC-ECG
R274 = RESISTOR_Dup2: RES 4.7K 1/16W 5% 0402; Part Reference: R274; Mistral Part No: 110011060001-R; Mfr_name: YAGEO AMERICA; Mfr_part_number: RC0402JR-074K7L; Part_type: RESISTORS\FIXED; Project: TMDXCSK368; Voltage: NA; Customs_HS_Code: 85332119; Custom_Duty: 15%; Value: 4.7K; PCB Footprint: RES0402_0-5; Footprint Path: Y:\MIS_DATABASE\Library\ALTIUM_TOOL\PCB_FOOTPRINTS\Altium_Footprint_Lib.PcbLib; Library Path: Y:\MIS_DATABASE\Library\ALTIUM_TOOL\SCHEMATICS_PARTS\MS_DISCRETE_Library.schlib; MECHANICAL 3D STEP FILE: RES0402_0-5; Footprint Ref: RES0402_0-5; Tolerance: 5%; Wattage: 1/16W; Package: 0402; Distributor_name: DIGIKEY; Distributor_part_number: 311-4.7KJRCT-ND; Height: 0.40MM; Weight: 0.65mg; Temperature: -55°C+155°C; Datasheet: Y:\MIS_DATABASE\DATASHEETS\RESISTORS\RCXXXXL-SER_MAR18.PDF; Crtd /date: VASANTHA/130516; Chkd/date: VASANTHA/130516; Library Ref: RESISTOR; Manufacturer: YAGEO AMERICA
R275 = RESISTOR_Dup2: RES 10K 1/16W 5% 0402; Part Reference: R275; Mistral Part No: 110011060021-R; Mfr_name: YAGEO AMERICA; Mfr_part_number: RC0402JR-0710KL; Part_type: RESISTORS\FIXED; Project: HSE; Voltage: NA; Customs_HS_Code: 85332119; Custom_Duty: 15%; Value: 10K; PCB Footprint: RES0402_0-5; Tolerance: 5%; Wattage: 1/16W; Package: 0402; Distributor_name: DIGIKEY; Distributor_part_number: 311-10KJRCT-ND; Height: 0.40MM; Weight: 0.65mg; Temperature: -55°C+155°C; Datasheet: Y:\MIS_DATABASE\DATASHEETS\RESISTORS\RCXXXXL-SER_MAR18.PDF; Crtd /date: MAZHAR/230805; Chkd/date: VASANTHA/061216; MECHANICAL 3D STEP FILE: RES0402_0-5; Library Ref: RESISTOR; Footprint Ref: RES0402_0-5; Library Path: Y:\MIS_DATABASE\Library\ALTIUM_TOOL\SCHEMATICS_PARTS\MS_DISCRETE_Library.schlib; Footprint Path: Y:\MIS_DATABASE\Library\ALTIUM_TOOL\PCB_FOOTPRINTS\Altium_Footprint_Lib.PcbLib; Manufacturer: YAGEO AMERICA
R561 = RESISTOR_Dup1: RES 0E 1/10W JUMPER 0402; Part Reference: R561; Part_type: RESISTORS\FIXED; Mfr_part_number: ERJ-2GE0R00X; Mfr_name: PANASONIC-ECG; Mistral Part No: 110018030052-R; Custom_Duty: 15%; Customs_HS_Code: 85332119; Voltage: NA; Project: AEGIS POM; IBISSP_MODLES: VALUE REPEATING 2 TIME; Value: 0E; PCB Footprint: RES0402_0-5; Footprint Path: Y:\MIS_DATABASE\Library\ALTIUM_TOOL\PCB_FOOTPRINTS\Altium_Footprint_Lib.PcbLib; Library Path: Y:\MIS_DATABASE\Library\ALTIUM_TOOL\SCHEMATICS_PARTS\MS_DISCRETE_Library.schlib; Footprint Ref: RES0402_0-5; Library Ref: RESISTOR; Chkd/date: VASANTHA/061216; Crtd /date: NAVEED/201014; Datasheet: Y:\MIS_DATABASE\DATASHEETS\RESISTORS\PAN-ERJSER_NOV17.PDF; Temperature: -55°C+155°C; Weight: 0.8mg; Height: 0.40MM; Distributor_part_number: P0.0JCT-ND; Distributor_name: DIGIKEY; Package: 0402; Wattage: 1/10W; Tolerance: NA; MECHANICAL 3D STEP FILE: RES0402_0-5; Manufacturer: PANASONIC-ECG
R562 = RESISTOR_Dup1: RES 0E 1/10W JUMPER 0402; Part Reference: R562; Mistral Part No: 110018030052-R; Mfr_name: PANASONIC-ECG; Mfr_part_number: ERJ-2GE0R00X; Part_type: RESISTORS\FIXED; Project: AEGIS POM; Tolerance: NA; Customs_HS_Code: 85332119; Custom_Duty: 15%; IBISSP_MODLES: VALUE REPEATING 2 TIME; Value: 0E; PCB Footprint: RES0402_0-5; MECHANICAL 3D STEP FILE: RES0402_0-5; Voltage: NA; Wattage: 1/10W; Package: 0402; Distributor_name: DIGIKEY; Distributor_part_number: P0.0JCT-ND; Height: 0.40MM; Weight: 0.8mg; Temperature: -55°C+155°C; Datasheet: Y:\MIS_DATABASE\DATASHEETS\RESISTORS\PAN-ERJSER_NOV17.PDF; Crtd /date: NAVEED/201014; Chkd/date: VASANTHA/061216; Library Ref: RESISTOR; Footprint Ref: RES0402_0-5; Library Path: Y:\MIS_DATABASE\Library\ALTIUM_TOOL\SCHEMATICS_PARTS\MS_DISCRETE_Library.schlib; Footprint Path: Y:\MIS_DATABASE\Library\ALTIUM_TOOL\PCB_FOOTPRINTS\Altium_Footprint_Lib.PcbLib; Manufacturer: PANASONIC-ECG
R563 = RESISTOR_Dup1: RES 0E 1/10W JUMPER 0402; Part Reference: R563; Part_type: RESISTORS\FIXED; Mfr_part_number: ERJ-2GE0R00X; Mfr_name: PANASONIC-ECG; Mistral Part No: 110018030052-R; Custom_Duty: 15%; Customs_HS_Code: 85332119; Voltage: NA; Project: AEGIS POM; IBISSP_MODLES: VALUE REPEATING 2 TIME; Value: 0E; PCB Footprint: RES0402_0-5; Footprint Path: Y:\MIS_DATABASE\Library\ALTIUM_TOOL\PCB_FOOTPRINTS\Altium_Footprint_Lib.PcbLib; Library Path: Y:\MIS_DATABASE\Library\ALTIUM_TOOL\SCHEMATICS_PARTS\MS_DISCRETE_Library.schlib; Footprint Ref: RES0402_0-5; Library Ref: RESISTOR; Chkd/date: VASANTHA/061216; Crtd /date: NAVEED/201014; Datasheet: Y:\MIS_DATABASE\DATASHEETS\RESISTORS\PAN-ERJSER_NOV17.PDF; Temperature: -55°C+155°C; Weight: 0.8mg; Height: 0.40MM; Distributor_part_number: P0.0JCT-ND; Distributor_name: DIGIKEY; Package: 0402; Wattage: 1/10W; Tolerance: NA; MECHANICAL 3D STEP FILE: RES0402_0-5; Manufacturer: PANASONIC-ECG
R609 = RESISTOR_Dup2: RES 0E 1/20W JUMPER 0201; Part Reference: R609; Mistral Part No: 110009030078-R; Mfr_name: PANASONIC-ECG; Mfr_part_number: ERJ-1GN0R00C; Part_type: RESISTORS\FIXED; Project: SRMS-SAR_BRD; Tolerance: NA; Customs_HS_Code: 85332119; Custom_Duty: 15%; Value: 0E; Footprint Ref: RES0201_0-5; Voltage: NA; Wattage: 1/20W; Package: 0201; Distributor_name: DIGIKEY; Distributor_part_number: P15979CT-ND; Library Ref: RESISTOR; Height: 0.26MM; Weight: 0.15mg; Temperature: -55°C+125°C; Datasheet: Y:\MIS_DATABASE\DATASHEETS\RESISTORS\PAN-ERJSER_NOV17.PDF; Crtd /date: ALVY/290421; Chkd/date: MANIRAJA/290421; MECHANICAL 3D STEP FILE: RES0201_0-5; Library Path: Y:\MIS_DATABASE\Library\ALTIUM_TOOL\SCHEMATICS_PARTS\MS_DISCRETE_Library.schlib; Footprint Path: Y:\MIS_DATABASE\Library\ALTIUM_TOOL\PCB_FOOTPRINTS\Altium_Footprint_Lib.PcbLib; PCB Footprint: RES0201_0-5
R610 = RESISTOR_Dup2: RES 0E 1/20W JUMPER 0201; Part Reference: R610; Part_type: RESISTORS\FIXED; Mfr_part_number: ERJ-1GN0R00C; Mfr_name: PANASONIC-ECG; Mistral Part No: 110009030078-R; Custom_Duty: 15%; Customs_HS_Code: 85332119; Voltage: NA; Project: SRMS-SAR_BRD; Value: 0E; Footprint Path: Y:\MIS_DATABASE\Library\ALTIUM_TOOL\PCB_FOOTPRINTS\Altium_Footprint_Lib.PcbLib; Library Path: Y:\MIS_DATABASE\Library\ALTIUM_TOOL\SCHEMATICS_PARTS\MS_DISCRETE_Library.schlib; MECHANICAL 3D STEP FILE: RES0201_0-5; Chkd/date: MANIRAJA/290421; Crtd /date: ALVY/290421; Datasheet: Y:\MIS_DATABASE\DATASHEETS\RESISTORS\PAN-ERJSER_NOV17.PDF; Temperature: -55°C+125°C; Weight: 0.15mg; Height: 0.26MM; Library Ref: RESISTOR; Distributor_part_number: P15979CT-ND; Distributor_name: DIGIKEY; Package: 0201; Wattage: 1/20W; Tolerance: NA; Footprint Ref: RES0201_0-5; PCB Footprint: RES0201_0-5
R611 = RESISTOR_Dup2: RES 0E 1/20W JUMPER 0201; Part Reference: R611; Mistral Part No: 110009030078-R; Mfr_name: PANASONIC-ECG; Mfr_part_number: ERJ-1GN0R00C; Part_type: RESISTORS\FIXED; Project: SRMS-SAR_BRD; Tolerance: NA; Customs_HS_Code: 85332119; Custom_Duty: 15%; Value: 0E; Footprint Ref: RES0201_0-5; Voltage: NA; Wattage: 1/20W; Package: 0201; Distributor_name: DIGIKEY; Distributor_part_number: P15979CT-ND; Library Ref: RESISTOR; Height: 0.26MM; Weight: 0.15mg; Temperature: -55°C+125°C; Datasheet: Y:\MIS_DATABASE\DATASHEETS\RESISTORS\PAN-ERJSER_NOV17.PDF; Crtd /date: ALVY/290421; Chkd/date: MANIRAJA/290421; MECHANICAL 3D STEP FILE: RES0201_0-5; Library Path: Y:\MIS_DATABASE\Library\ALTIUM_TOOL\SCHEMATICS_PARTS\MS_DISCRETE_Library.schlib; Footprint Path: Y:\MIS_DATABASE\Library\ALTIUM_TOOL\PCB_FOOTPRINTS\Altium_Footprint_Lib.PcbLib; PCB Footprint: RES0201_0-5
R612 = RESISTOR_Dup2: RES 0E 1/20W JUMPER 0201; Part Reference: R612; Mistral Part No: 110009030078-R; Mfr_name: PANASONIC-ECG; Mfr_part_number: ERJ-1GN0R00C; Part_type: RESISTORS\FIXED; Project: SRMS-SAR_BRD; Tolerance: NA; Customs_HS_Code: 85332119; Custom_Duty: 15%; Value: 0E; Footprint Ref: RES0201_0-5; Voltage: NA; Wattage: 1/20W; Package: 0201; Distributor_name: DIGIKEY; Distributor_part_number: P15979CT-ND; Library Ref: RESISTOR; Height: 0.26MM; Weight: 0.15mg; Temperature: -55°C+125°C; Datasheet: Y:\MIS_DATABASE\DATASHEETS\RESISTORS\PAN-ERJSER_NOV17.PDF; Crtd /date: ALVY/290421; Chkd/date: MANIRAJA/290421; MECHANICAL 3D STEP FILE: RES0201_0-5; Library Path: Y:\MIS_DATABASE\Library\ALTIUM_TOOL\SCHEMATICS_PARTS\MS_DISCRETE_Library.schlib; Footprint Path: Y:\MIS_DATABASE\Library\ALTIUM_TOOL\PCB_FOOTPRINTS\Altium_Footprint_Lib.PcbLib; PCB Footprint: RES0201_0-5
TP86 = TESTPOINT_Dup1: TESTPOINT CIR 40 SMD; Part Reference: TP86; Manufacturer: LOCAL; Mistral Part No: 130009030933; Project: RAINIER-3; Tolerance: NA; Value: TP40_SMD; PCB Footprint: TP40_SMD; RoHS: NA; Footprint Path: Y:\MIS_DATABASE\Library\ALTIUM_TOOL\PCB_FOOTPRINTS\Altium_Footprint_Lib.PcbLib; Library Path: Y:\MIS_DATABASE\Library\ALTIUM_TOOL\SCHEMATICS_PARTS\MS_DISCRETE_Library.schlib; Chkd/date: MAZHAR/190505; Crtd /date: MAZHAR/190505; Height: NA; Distributor_part_number: NA; Distributor_name: NA; Package: SMD; Part_type: TESTPOINT; Mfr_part_number: TP40_SMD; Mfr_name: LOCAL; Voltage: NA; Wattage: NA; Weight: NA; Temperature: NA; Datasheet: NA; MECHANICAL 3D STEP FILE: NA; Library Ref: TESTPOINT; Footprint Ref: TP40_SMD
TP87 = TESTPOINT_Dup1: TESTPOINT CIR 40 SMD; Part Reference: TP87; Mistral Part No: 130009030933; Mfr_name: LOCAL; MECHANICAL 3D STEP FILE: NA; Project: RAINIER-3; Value: TP40_SMD; PCB Footprint: TP40_SMD; Footprint Ref: TP40_SMD; Library Ref: TESTPOINT; Datasheet: NA; Temperature: NA; Weight: NA; Wattage: NA; Voltage: NA; Tolerance: NA; Mfr_part_number: TP40_SMD; Part_type: TESTPOINT; Package: SMD; Distributor_name: NA; Distributor_part_number: NA; Height: NA; Crtd /date: MAZHAR/190505; Chkd/date: MAZHAR/190505; Library Path: Y:\MIS_DATABASE\Library\ALTIUM_TOOL\SCHEMATICS_PARTS\MS_DISCRETE_Library.schlib; Footprint Path: Y:\MIS_DATABASE\Library\ALTIUM_TOOL\PCB_FOOTPRINTS\Altium_Footprint_Lib.PcbLib; RoHS: NA; Manufacturer: LOCAL
TP93 = TESTPOINT_Dup1: TESTPOINT CIR 40 SMD; Part Reference: TP93; Manufacturer: LOCAL; Mistral Part No: 130009030933; Project: RAINIER-3; Tolerance: NA; Value: TP40_SMD; PCB Footprint: TP40_SMD; RoHS: NA; Footprint Path: Y:\MIS_DATABASE\Library\ALTIUM_TOOL\PCB_FOOTPRINTS\Altium_Footprint_Lib.PcbLib; Library Path: Y:\MIS_DATABASE\Library\ALTIUM_TOOL\SCHEMATICS_PARTS\MS_DISCRETE_Library.schlib; Chkd/date: MAZHAR/190505; Crtd /date: MAZHAR/190505; Height: NA; Distributor_part_number: NA; Distributor_name: NA; Package: SMD; Part_type: TESTPOINT; Mfr_part_number: TP40_SMD; Mfr_name: LOCAL; Voltage: NA; Wattage: NA; Weight: NA; Temperature: NA; Datasheet: NA; MECHANICAL 3D STEP FILE: NA; Library Ref: TESTPOINT; Footprint Ref: TP40_SMD
U50 = TCA6416ARTWR_WQFN24: IC I2C I/O EXPANDER 16Bit WQFN24; Part Reference: U50; Mistral Part No: 141016100001-R; Mfr_name: TEXAS INSTRUMENTS; Part_type: ICS\DIGITAL\BUSTRANSCEIVER; Project: OCTBTS5200_FEM; Tolerance: NA; Customs_HS_Code: 85423100; Custom_Duty: 15%; Value: TCA6416ARTWR; PCB Footprint: WQFN24_19-68_160X160; Mfr_part_number: TCA6416ARTWR; Voltage: NA; Wattage: NA; Package: WQFN24; Distributor_name: DIGIKEY; Distributor_part_number: 296-24826-1-ND; Library Ref: TCA6416ARTWR_WQFN24; Height: 0.80MM; Weight: NA; Temperature: -40°C+85°C; Datasheet: Y:\MIS_DATABASE\DATASHEETS\ICS\DIGITAL\BUSTRANSCEIVER\TCA6416.PDF; Crtd /date: VASANTHA/011016; Chkd/date: VASANTHA/011016